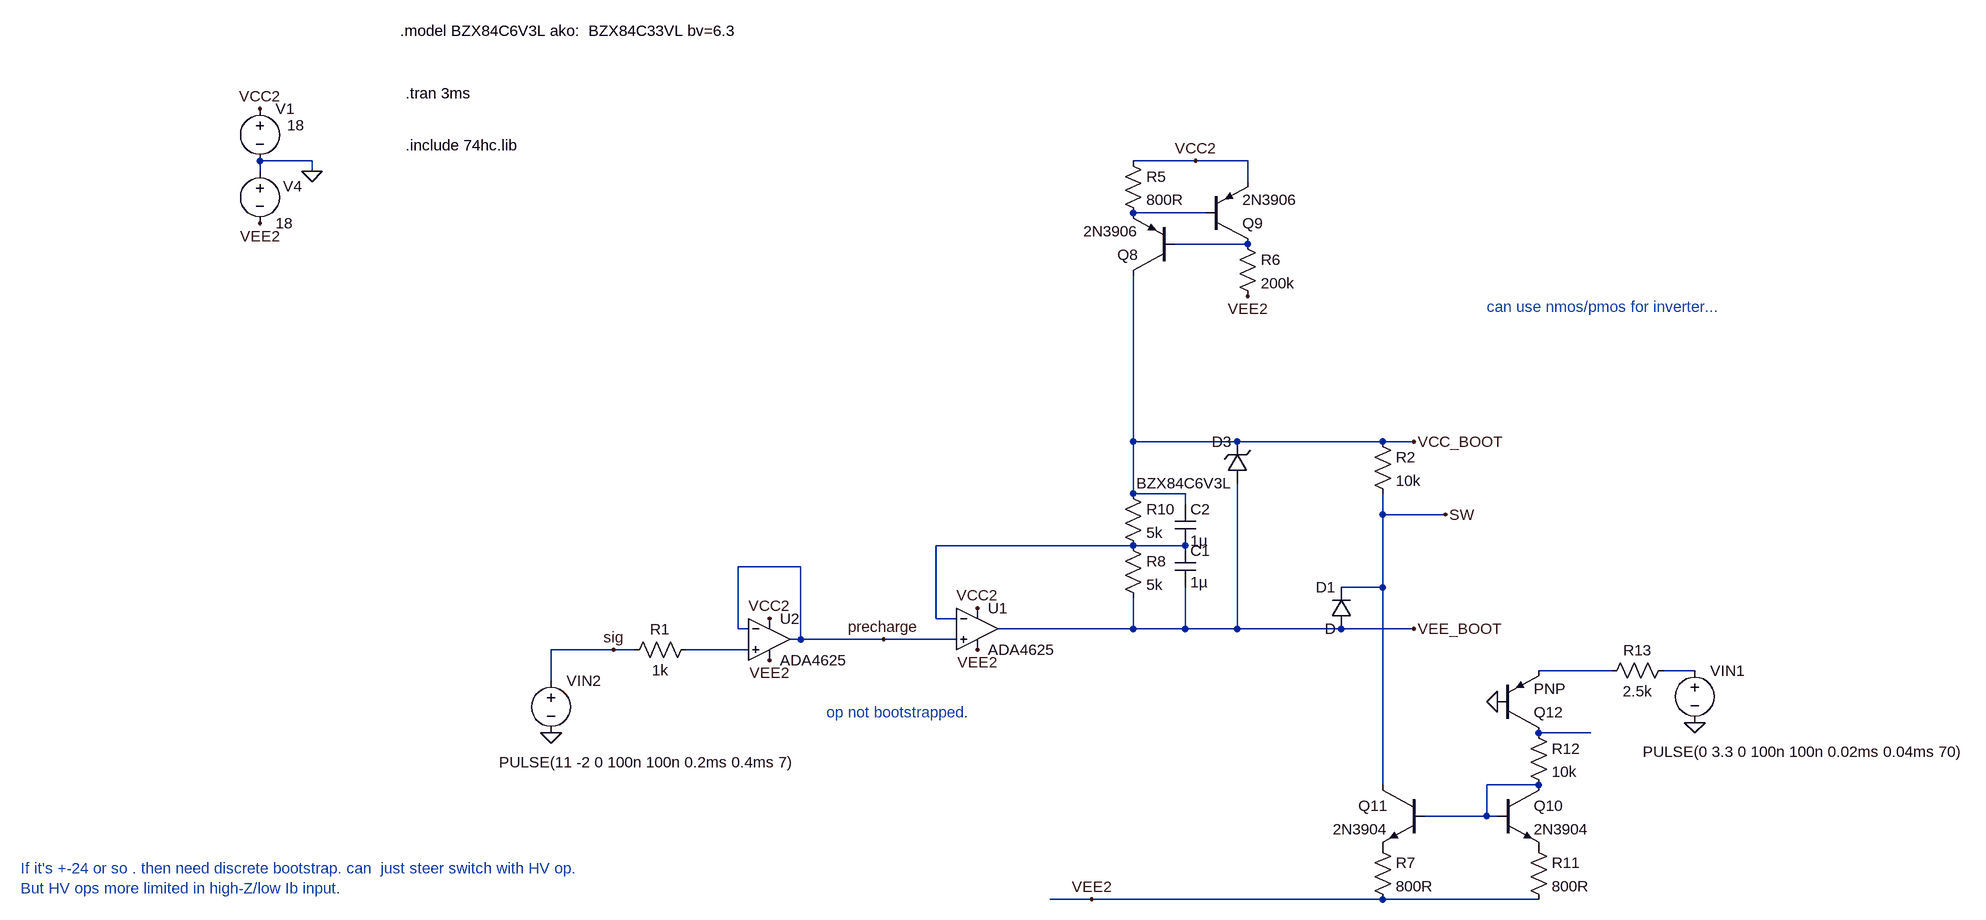
[diagram p0: schematic Draft57.asc]
Draft57.asc, the LTspice schematic file:
Version 4
SHEET 1 2756 1020
WIRE -256 -288 -336 -288
WIRE 1104 -288 1008 -288
WIRE 1184 -288 1104 -288
WIRE -336 -272 -336 -288
WIRE -256 -272 -256 -288
WIRE 1184 -256 1184 -288
WIRE 1120 -208 1008 -208
WIRE 1184 -160 1072 -160
WIRE 1008 144 1008 -112
WIRE 1168 144 1008 144
WIRE 1392 144 1168 144
WIRE 1440 144 1392 144
WIRE 1008 224 1008 144
WIRE 1088 224 1008 224
WIRE 1088 240 1088 224
WIRE 1392 256 1392 224
WIRE 1488 256 1392 256
WIRE 1008 304 704 304
WIRE 1088 304 1008 304
WIRE 496 336 400 336
WIRE 1392 368 1392 256
WIRE 1392 368 1328 368
WIRE 704 416 704 304
WIRE 736 416 704 416
WIRE 400 432 400 336
WIRE 416 432 400 432
WIRE 1008 432 1008 384
WIRE 1008 432 800 432
WIRE 1088 432 1088 368
WIRE 1088 432 1008 432
WIRE 1168 432 1168 208
WIRE 1168 432 1088 432
WIRE 1328 432 1168 432
WIRE 1440 432 1328 432
WIRE 496 448 496 336
WIRE 496 448 480 448
WIRE 624 448 496 448
WIRE 736 448 624 448
WIRE 208 464 112 464
WIRE 240 464 208 464
WIRE 416 464 320 464
WIRE 1744 496 1632 496
WIRE 1872 496 1824 496
WIRE 112 512 112 464
WIRE 1712 592 1632 592
WIRE 1392 672 1392 368
WIRE 1632 672 1552 672
WIRE 1552 720 1552 672
WIRE 1552 720 1456 720
WIRE 1568 720 1552 720
WIRE 944 848 880 848
WIRE 1392 848 944 848
WIRE 1632 848 1392 848
FLAG -256 -272 0
FLAG -336 -368 VCC2
FLAG -336 -192 VEE2
FLAG 944 848 VEE2
FLAG 112 592 0
FLAG 1440 144 VCC_BOOT
FLAG 1440 432 VEE_BOOT
FLAG 1104 -288 VCC2
FLAG 1488 256 SW
FLAG 1872 576 0
FLAG 1568 544 0
FLAG 768 400 VCC2
FLAG 768 464 VEE2
FLAG 448 416 VCC2
FLAG 448 480 VEE2
FLAG 624 448 precharge
FLAG 208 464 sig
FLAG 1184 -80 VEE2
SYMBOL voltage -336 -384 R0
WINDOW 123 0 0 Left 0
WINDOW 39 0 0 Left 0
WINDOW 3 42 41 Left 2
SYMATTR Value 18
SYMATTR InstName V1
SYMBOL voltage -336 -288 R0
WINDOW 123 0 0 Left 0
WINDOW 39 0 0 Left 0
WINDOW 0 36 39 Left 2
SYMATTR InstName V4
SYMATTR Value 18
SYMBOL voltage 112 496 R0
WINDOW 123 0 0 Left 0
WINDOW 39 0 0 Left 0
WINDOW 3 -80 141 Left 2
SYMATTR Value PULSE(11 -2 0 100n 100n 0.2ms 0.4ms 7)
SYMATTR InstName VIN2
SYMBOL res 336 448 R90
WINDOW 0 0 56 VBottom 2
WINDOW 3 32 56 VTop 2
SYMATTR InstName R1
SYMATTR Value 1k
SYMBOL pnp 1072 -112 R180
SYMATTR InstName Q8
SYMATTR Value 2N3906
SYMBOL pnp 1120 -160 M180
SYMATTR InstName Q9
SYMATTR Value 2N3906
SYMBOL res 992 -304 R0
SYMATTR InstName R5
SYMATTR Value 800R
SYMBOL res 1168 -176 R0
SYMATTR InstName R6
SYMATTR Value 200k
SYMBOL res 992 288 R0
SYMATTR InstName R8
SYMATTR Value 5k
SYMBOL res 992 208 R0
SYMATTR InstName R10
SYMATTR Value 5k
SYMBOL res 1376 128 R0
SYMATTR InstName R2
SYMATTR Value 10k
SYMBOL diode 1344 432 R180
WINDOW 0 24 64 Left 2
WINDOW 3 24 0 Left 2
SYMATTR InstName D1
SYMBOL npn 1568 672 R0
SYMATTR InstName Q10
SYMATTR Value 2N3904
SYMBOL npn 1456 672 M0
SYMATTR InstName Q11
SYMATTR Value 2N3904
SYMBOL res 1376 752 R0
SYMATTR InstName R7
SYMATTR Value 800R
SYMBOL res 1616 752 R0
SYMATTR InstName R11
SYMATTR Value 800R
SYMBOL voltage 1872 480 R0
WINDOW 123 0 0 Left 0
WINDOW 39 0 0 Left 0
WINDOW 3 -80 141 Left 2
SYMATTR Value PULSE(0 3.3 0 100n 100n 0.02ms 0.04ms 70)
SYMATTR InstName VIN1
SYMBOL res 1616 576 R0
SYMATTR InstName R12
SYMATTR Value 10k
SYMBOL pnp 1568 592 M180
SYMATTR InstName Q12
SYMBOL res 1840 480 R90
WINDOW 0 0 56 VBottom 2
WINDOW 3 32 56 VTop 2
SYMATTR InstName R13
SYMATTR Value 2.5k
SYMBOL OpAmps\\ADA4625 768 368 R0
SYMATTR InstName U1
SYMBOL cap 1072 304 R0
SYMATTR InstName C1
SYMATTR Value 1µ
SYMBOL cap 1072 240 R0
SYMATTR InstName C2
SYMATTR Value 1µ
SYMBOL OpAmps\\ADA4625 448 384 R0
SYMATTR InstName U2
SYMBOL zener 1184 208 R180
WINDOW 0 24 64 Left 2
WINDOW 3 24 0 Left 2
SYMATTR InstName D3
SYMATTR Value BZX84C6V3L
TEXT -112 -392 Left 2 !.tran 3ms
TEXT -704 800 Left 2 ;If it's +-24 or so . then need discrete bootstrap. can  just steer switch with HV op.\nBut HV ops more limited in high-Z/low Ib input.
TEXT -120 -488 Left 2 !.model BZX84C6V3L ako:  BZX84C33VL bv=6.3
TEXT 536 560 Left 2 ;op not bootstrapped.
TEXT -112 -312 Left 2 !.include 74hc.lib
TEXT 1552 -64 Left 2 ;can use nmos/pmos for inverter...

The netlist it stands for:
* Draft57.asc
V1 VCC2 0 18
V4 0 VEE2 18
VIN2 sig 0 PULSE(11 -2 0 100n 100n 0.2ms 0.4ms 7)
R1 N004 sig 1k
Q8 VCC_BOOT N002 N001 0 2N3906
Q9 N002 N001 VCC2 0 2N3906
R5 VCC2 N001 800R
R6 N002 VEE2 200k
R8 N003 VEE_BOOT 5k
R10 VCC_BOOT N003 5k
R2 VCC_BOOT SW 10k
D1 VEE_BOOT SW D
Q10 N008 N008 P001 0 2N3904
Q11 SW N008 P002 0 2N3904
R7 P002 VEE2 800R
R11 P001 VEE2 800R
VIN1 N006 0 PULSE(0 3.3 0 100n 100n 0.02ms 0.04ms 70)
R12 N007 N008 10k
Q12 N007 0 N005 0 PNP
R13 N006 N005 2.5k
XU1 precharge N003 VCC2 VEE2 VEE_BOOT ADA4625  ; pins In+ In- V+ V- OUT
C1 N003 VEE_BOOT 1µ
C2 VCC_BOOT N003 1µ
XU2 N004 precharge VCC2 VEE2 precharge ADA4625  ; pins In+ In- V+ V- OUT
D3 VEE_BOOT VCC_BOOT BZX84C6V3L
.model D D
.lib standard.dio
.model NPN NPN
.model PNP PNP
.lib standard.bjt
.tran 3ms
* If it's +-24 or so . then need discrete bootstrap. can  just steer switch with HV op.
* But HV ops more limited in high-Z/low Ib input.
.model BZX84C6V3L ako:  BZX84C33VL bv=6.3
* op not bootstrapped.
.include 74hc.lib
* can use nmos/pmos for inverter...
.backanno
.end